# Altium schematic sheet Block_Diagram.SchDoc
size A2; SheetNumber: 1; SheetTotal: 2
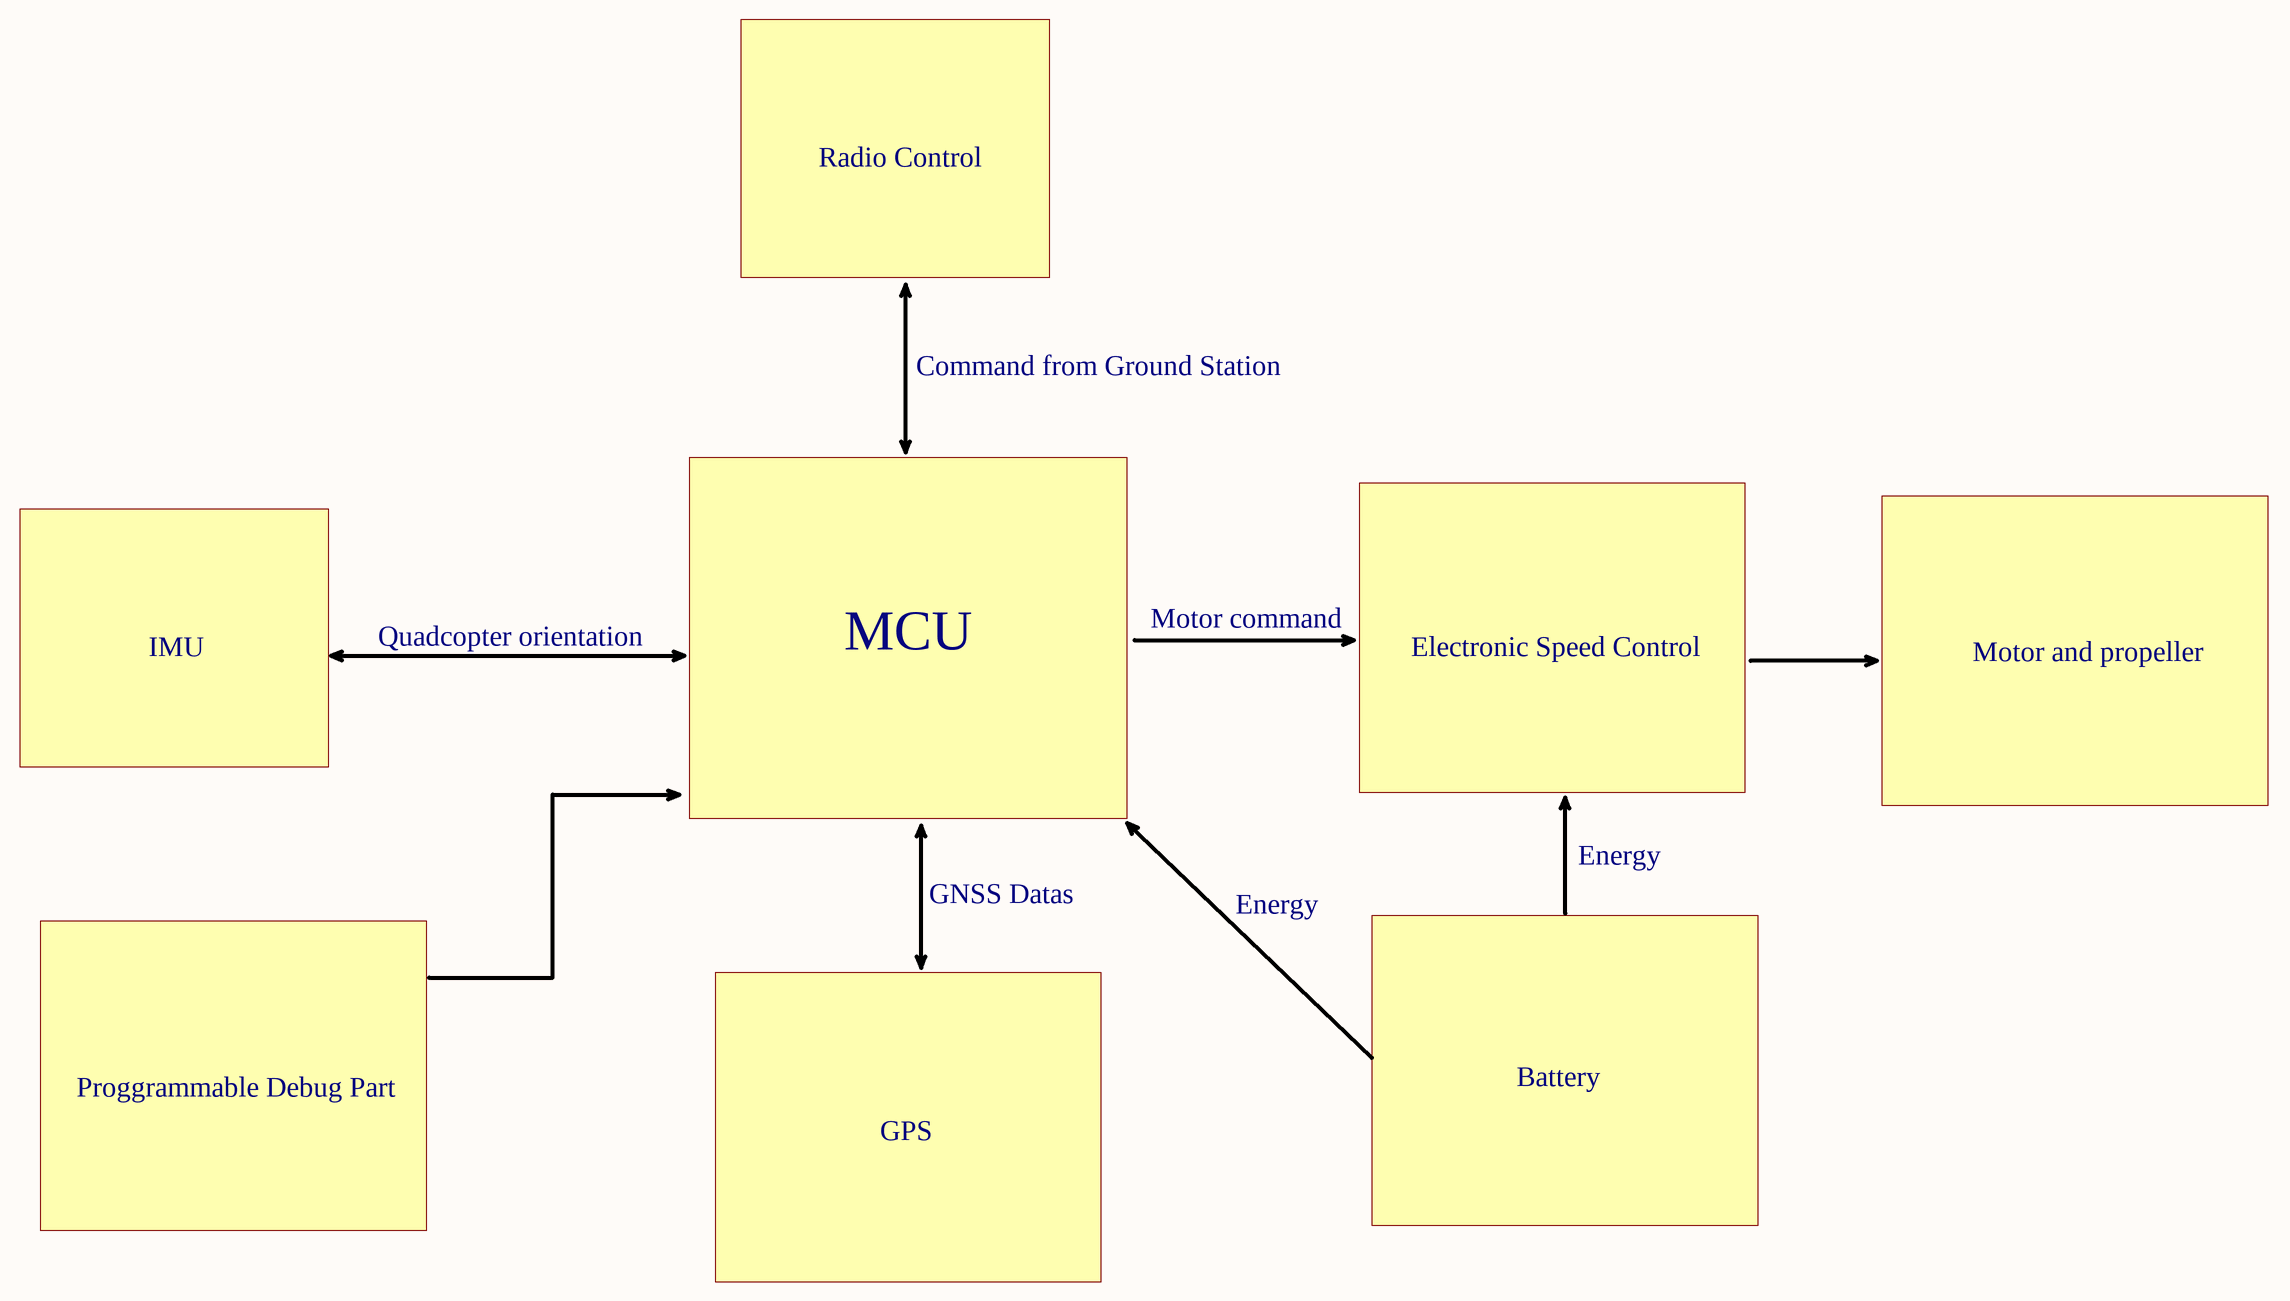
[diagram p0: Block_Diagram.SchDoc]

## Notes on the sheet
- Radio Control
- Command from Ground Station
- Motor command
- IMU
- Quadcopter orientation
- MCU
- Electronic Speed Control
- Motor and propeller
- GNSS Datas
- Energy
- Proggrammable Debug Part
- Battery
- GPS